# Altium schematic sheet RS232.SchDoc: RS232
size A4; DocumentNumber: MB1246; Revision: B.1; SheetNumber: 10; SheetTotal: 17; Project: STM32H7xxI-EVAL
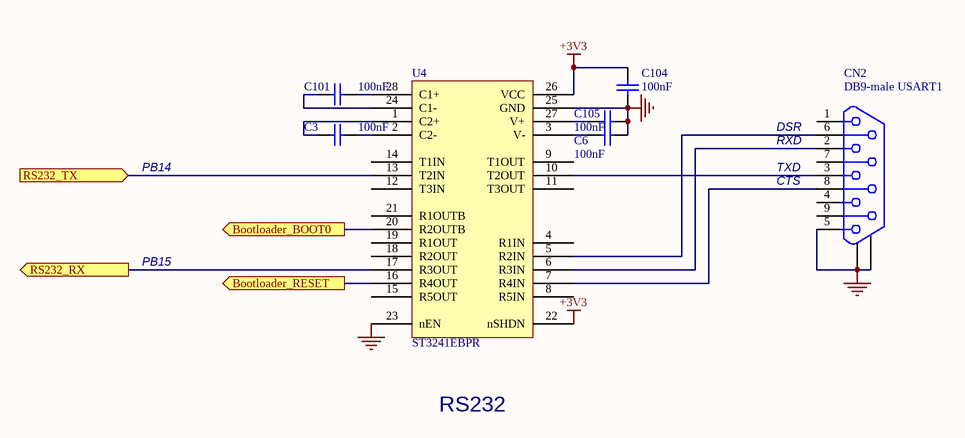
[diagram p0: RS232.SchDoc]

## Parts
C3  100nF  [0603C]
C6  100nF  [0603C]
C101  100nF  [0603C]
C104  100nF  [0603C]
C105  100nF  [0603C]
CN2  DB9-male USART1  [DB9/M]
U4  ST3241EBPR  [SSOP28_0R65_10R2X7R8]

## Ports
Bootloader_BOOT0 (out), Bootloader_RESET (out), RS232_RX (out), RS232_TX (in)

## Nets
+3V3: C104.1 U4.22(nSHDN) U4.26(VCC)
GND: C6.1 C104.2 C105.1 CN2.5 CN2.10 CN2.11 U4.23(nEN) U4.25(GND)
Bootloader_BOOT0: U4.20(R2OUTB) ; port Bootloader_BOOT0
Bootloader_RESET: U4.16(R4OUT) ; port Bootloader_RESET
RS232_RX: U4.17(R3OUT) ; port RS232_RX
RS232_TX: U4.13(T2IN) ; port RS232_TX
NetC3_1: C3.1 U4.1(C2+)
NetC3_2: C3.2 U4.2(C2-)
NetC6_2: C6.2 U4.3(V-)
NetC101_1: C101.1 U4.24(C1-)
NetC101_2: C101.2 U4.28(C1+)
NetC105_2: C105.2 U4.27(V+)
NetCN2_2: CN2.2 U4.6(R3IN)
NetCN2_3: CN2.3 U4.10(T2OUT)
NetCN2_6: CN2.6 U4.5(R2IN)
NetCN2_8: CN2.8 U4.7(R4IN)

Not connected (* = marked no-connect by the designer): CN2 1 4 7 9; U4 4(R1IN) 8(R5IN) 9(T1OUT) 11(T3OUT) 12(T3IN) 14(T1IN) 15(R5OUT) 18(R2OUT) 19(R1OUT) 21(R1OUTB)

## Notes on the sheet
- PB14
- (near CN2) RXD
- (near CN2) TXD
- (near CN2) DSR
- (near CN2) CTS
- PB15
- RS232
- Title:
- Project:
- Size:
- Date:
- A4
- Reference:
- Sheet:
- Revision:
- of

## Library data of the parts
C3 C6 C101 C104 C105 = Cap: Capacitor; Value: 10nF; Published: 8-Jun-2000; Revision: July-2002: Re-released for DXP Platform.; Publisher: Altium Limited
CN2 = DB9-USART
U4 = ST3241